# EAGLE design CapteurHumidite (EAGLE 9.5.0)
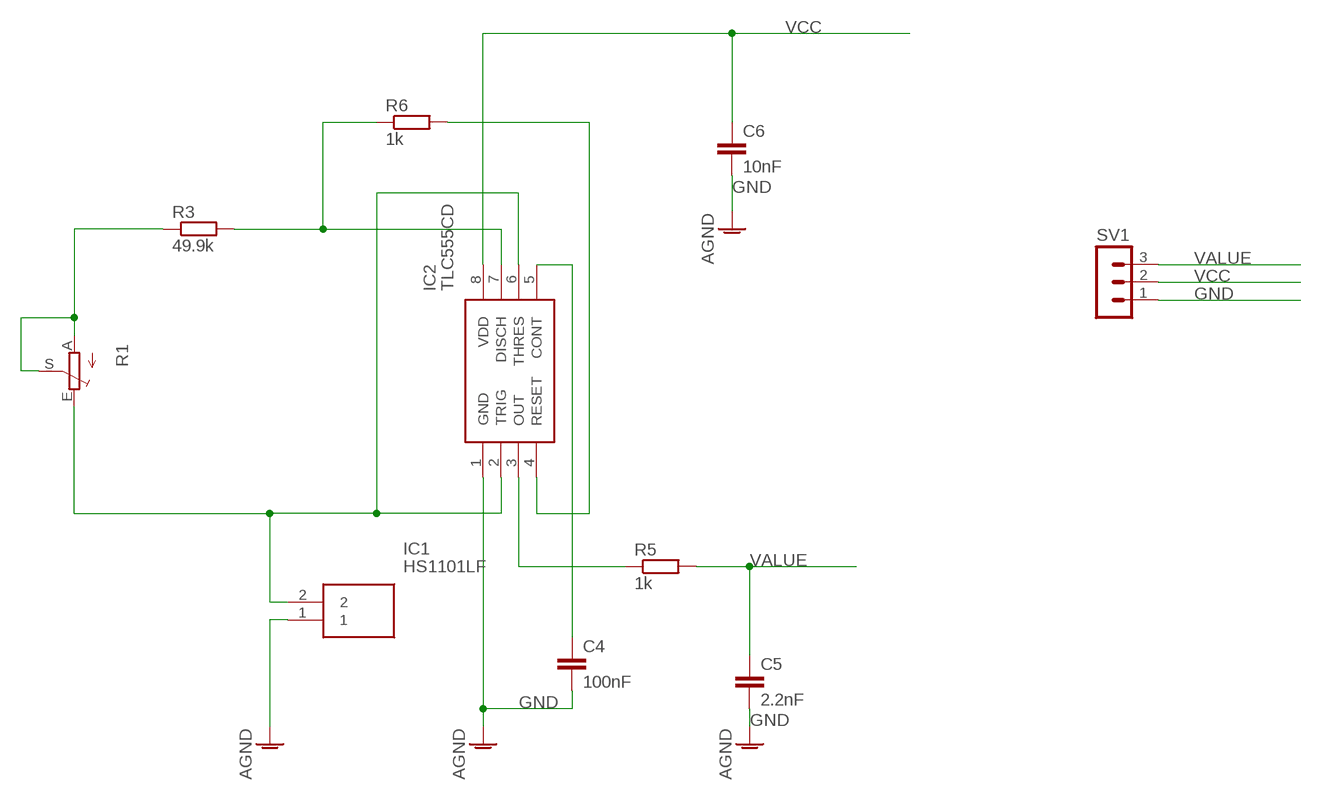
[diagram p0: schematic, sheet 1]

## Parts
C4  100nF  C-EUC0603  [C0603]
C5  2.2nF  C-EUC0603  [C0603]
C6  10nF  C-EUC0603  [C0603]
IC1  HS1101LF  [HS1101LF]
IC2  TLC555CD  [SOIC127P600X175-8N]
R1  TRIM_EU-B25P  [B25P]
R3  49.9k  R-EU_R0603  [R0603]
R5  1k  R-EU_R0603  [R0603]
R6  1k  R-EU_R0603  [R0603]
SV1  MA03-1  [MA03-1]

## Nets
GND: C4.2 C5.2 C6.2 IC1.1 IC2.1(GND) SV1.1 ; supply symbol labelled AGND
N$1: IC2.7(DISCH) R3.2 R6.1
N$2: IC2.4(RESET) R6.2
N$4: R1.A R1.S R3.1
N$5: C4.1 IC2.5(CONT)
N$6: IC2.3(OUT) R5.1
N$7: IC1.2 IC2.2(TRIG) IC2.6(THRES) R1.E
VALUE: C5.1 R5.2 SV1.3
VCC: C6.1 IC2.8(VDD) SV1.2

## Library data of the parts
C4-C6 = rcl:C-EU: CAPACITOR, European symbol; SPICEPREFIX: C
IC1 = HS1101LF:HS1101LF: Board Mount Humidity Sensors -60 to 140 Oper Temp 10 VAC Supply Volt Source: Datasheet <https://www.te.com/commerce/DocumentDelivery/DDEController?Action=showdoc&DocId=Data SheetHPC052_JApdfEnglishENG_DS_HPC052_J_A.pdfCAT-HSC0006>; DESCRIPTION: Board Mount Humidity Sensors -60 to 140 Oper Temp 10 VAC Supply Volt; HEIGHT: 6.2mm; MANUFACTURER_NAME: TE Connectivity; MANUFACTURER_PART_NUMBER: HS1101LF; MOUSER_PART_NUMBER: 824-HS1101LF; MOUSER_PRICE-STOCK: https://www.mouser.com/Search/Refine.aspx?Keyword=824-HS1101LF
IC2 = TLC555CD:TLC555CD: TLC555CDG4, Timer 2MHz, 2 to 15V, 8-Pin SOIC-8 Source: Datasheet <http://www.ti.com/lit/ds/symlink/tlc555.pdf>; ARROW_PART_NUMBER: TLC555CD; ARROW_PRICE-STOCK: https://www.arrow.com/en/products/tlc555cd/texas-instruments?region=nac; DESCRIPTION: TLC555CDG4, Timer 2MHz, 2 to 15V, 8-Pin SOIC-8; HEIGHT: 1.75mm; MANUFACTURER_NAME: Texas Instruments; MANUFACTURER_PART_NUMBER: TLC555CD; MOUSER_PART_NUMBER: 595-TLC555CD; MOUSER_PRICE-STOCK: https://www.mouser.co.uk/ProductDetail/Texas-Instruments/TLC555CD?qs=gb35HGp1gQIVnZRipcKQnw%3D%3D
R1 = pot:TRIM_EU-: POTENTIOMETER
R3 R5 R6 = rcl:R-EU_: RESISTOR, European symbol; SPICEPREFIX: R
SV1 = con-lstb:MA03-1: PIN HEADER; OC_FARNELL: unknown; OC_NEWARK: unknown

## Board
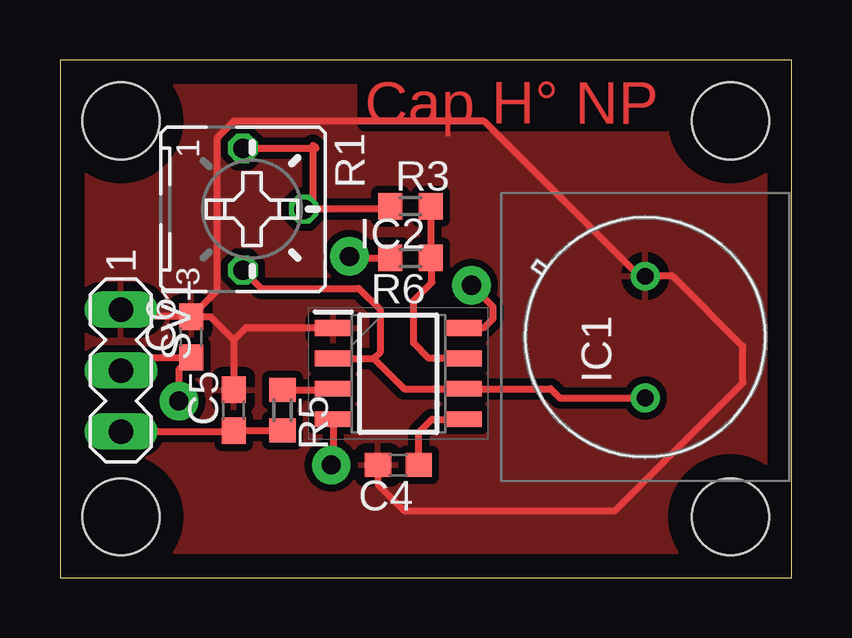
[diagram p1: board, top side]
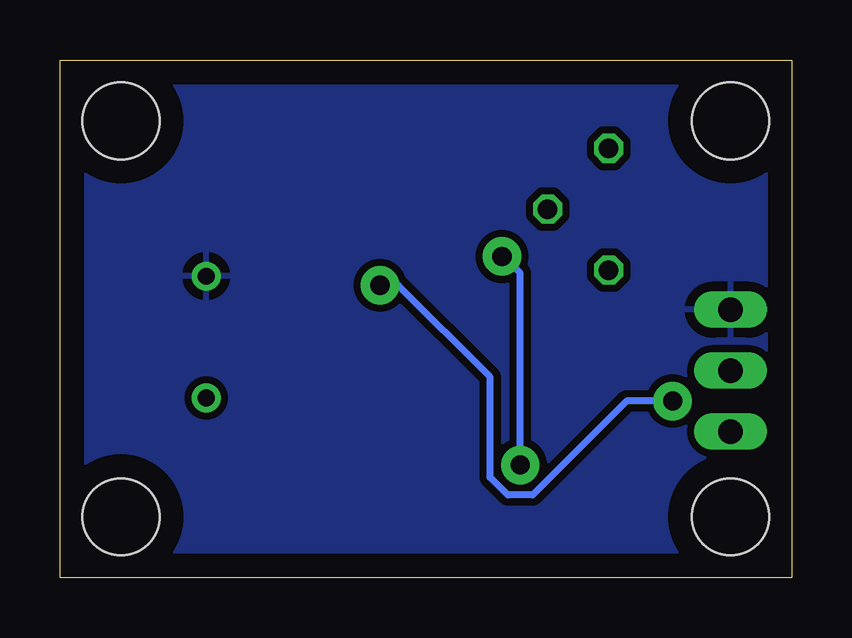
[diagram p2: board, bottom side, seen from below]

Size 30.48 x 21.59 mm. Coordinates in mm from the lower left corner, seen from the top.
Outline: 0,0 30.48,0 30.48,21.59 0,21.59 0,0
Copper layers (1*16): Top 0.035mm / dielectric 1.5mm / Bottom 0.035mm
Design rules "ENSEA_2022_04_08 *": minimum track width 0.2mm, minimum drill 0.6mm, track to track 0.3mm, track to pad 0.3mm, pad to pad 0.3mm, via to via 0.3mm, smd to smd 0.3mm, copper to edge 1mm, drill to drill 0.4mm, minimum pad ring 0.2mm, minimum via ring 0.2mm, stop-mask expansion 4mil, vias tented up to drill 0mil, thermal gap 0.4mm
Holes 3.2 mm at 2.54,2.54 2.54,19.05 27.94,19.05 27.94,2.54

### Footprints (pad centres in the part's own frame; a part is rotated, then mirrored left to right if it is on the bottom)
C0603 = smd 1.1 x 1: 1 -0.85,0; 2 0.85,0
HS1101LF = drill 0.7 pad 1.2: 1 0,0; 2 -5.08,0
SOIC127P600X175-8N = smd 1.528 x 0.65: 1 -2.711,1.905; 2 -2.711,0.635; 3 -2.711,-0.635; 4 -2.711,-1.905; 5 2.711,-1.905; 6 2.711,-0.635; 7 2.711,0.635; 8 2.711,1.905
B25P = drill 0.813 octagon: A -2.54,0; E 2.54,0; S 0,2.54
R0603 = smd 1 x 1.1: 1 -0.85,0; 2 0.85,0
MA03-1 = drill 1.016 long: 1 -2.54,0; 2 0,0; 3 2.54,0

### Placement (x,y rotation side)
C4  14.1,4.7 180 top
C5  7.24,6.99 90 top
C6  5.46,10.03 90 top
IC1  24.38,12.57 90 top
IC2  14.1,8.51 0 top
R1  7.62,15.37 270 top
R3  14.61,15.49 0 top
R5  9.27,6.99 270 top
R6  14.61,13.34 180 top
SV1  2.54,8.64 270 top

### Tracks (layer width: path | path; a pad name or v marks a point on that pad's centre or on a via)
GND
  Top 0.3: C6.2 2.83,10.88 SV1.1 | C6.2 6.26,10.88 7.24,9.91 | 7.24,9.91 C5.2 | IC2.1 7.75,10.41 7.24,9.91 | C4.2 13.25,3.9 14.35,2.79 23.11,2.79 28.45,8.13 28.45,9.65 25.53,12.57 IC1.1 24.13,12.57 17.65,19.05 7.26,19.05 6.56,18.35 6.56,11.98 C6.2
  pour Top: -0.25,21.84 -0.25,-0.51 30.86,-0.51 30.86,21.84 30.73,21.97 0,21.97 -0.13,21.84
  pour Bottom: -0.25,21.97 -0.25,-0.38 -0.38,-0.51 30.99,-0.51 30.99,21.84 30.86,21.97
N$1
  Top 0.3: R3.2 R6.1 15.49,13.3 15.49,12.32 14.73,11.56 14.73,9.78 15.37,9.14 IC2.7
N$2  (via drill 0.8 pad 1.6)
  Top 0.3: IC2.4 11.39,4.78 v11.3,4.7 | v12.06,13.4 12.13,13.34 R6.2
  Bottom 0.3: v11.3,4.7 11.3,12.7 12,13.4 v12.06,13.4
N$4
  Top 0.3: R1.A 10.67,17.91 10.54,18.03 10.54,15.75 R1.S 13.63,15.37 R3.1
N$5
  Top 0.3: C4.1 14.95,6.06 15.49,6.6 IC2.5
N$6
  Top 0.3: R5.1 11.35,7.83 IC2.3
N$7
  Top 0.3: IC1.2 20.83,7.49 20.45,7.87 IC2.6 14.35,7.87 13.08,9.14 | IC2.2 13.08,9.14 | R1.E 8.38,12.06 12.45,12.06 13.34,11.18 13.34,9.4 13.08,9.14
VALUE
  Top 0.3: R5.2 C5.1 7.2,6.1 SV1.3
VCC  (via drill 0.8 pad 1.6)
  Top 0.3: SV1.2 3.09,9.18 C6.1 4.95,8.68 v4.95,7.37 | v17.14,12.19 18.03,11.3 18.03,10.79 17.65,10.41 IC2.8
  Bottom 0.3: v4.95,7.37 6.87,7.37 10.79,3.45 11.82,3.45 12.55,4.18 12.55,8.36 16.38,12.19 v17.14,12.19

### Text on the board
Top: Cap H° NP